# EAGLE design Tingle v3 (EAGLE 7.2.0)

## Sheet 1 of 3
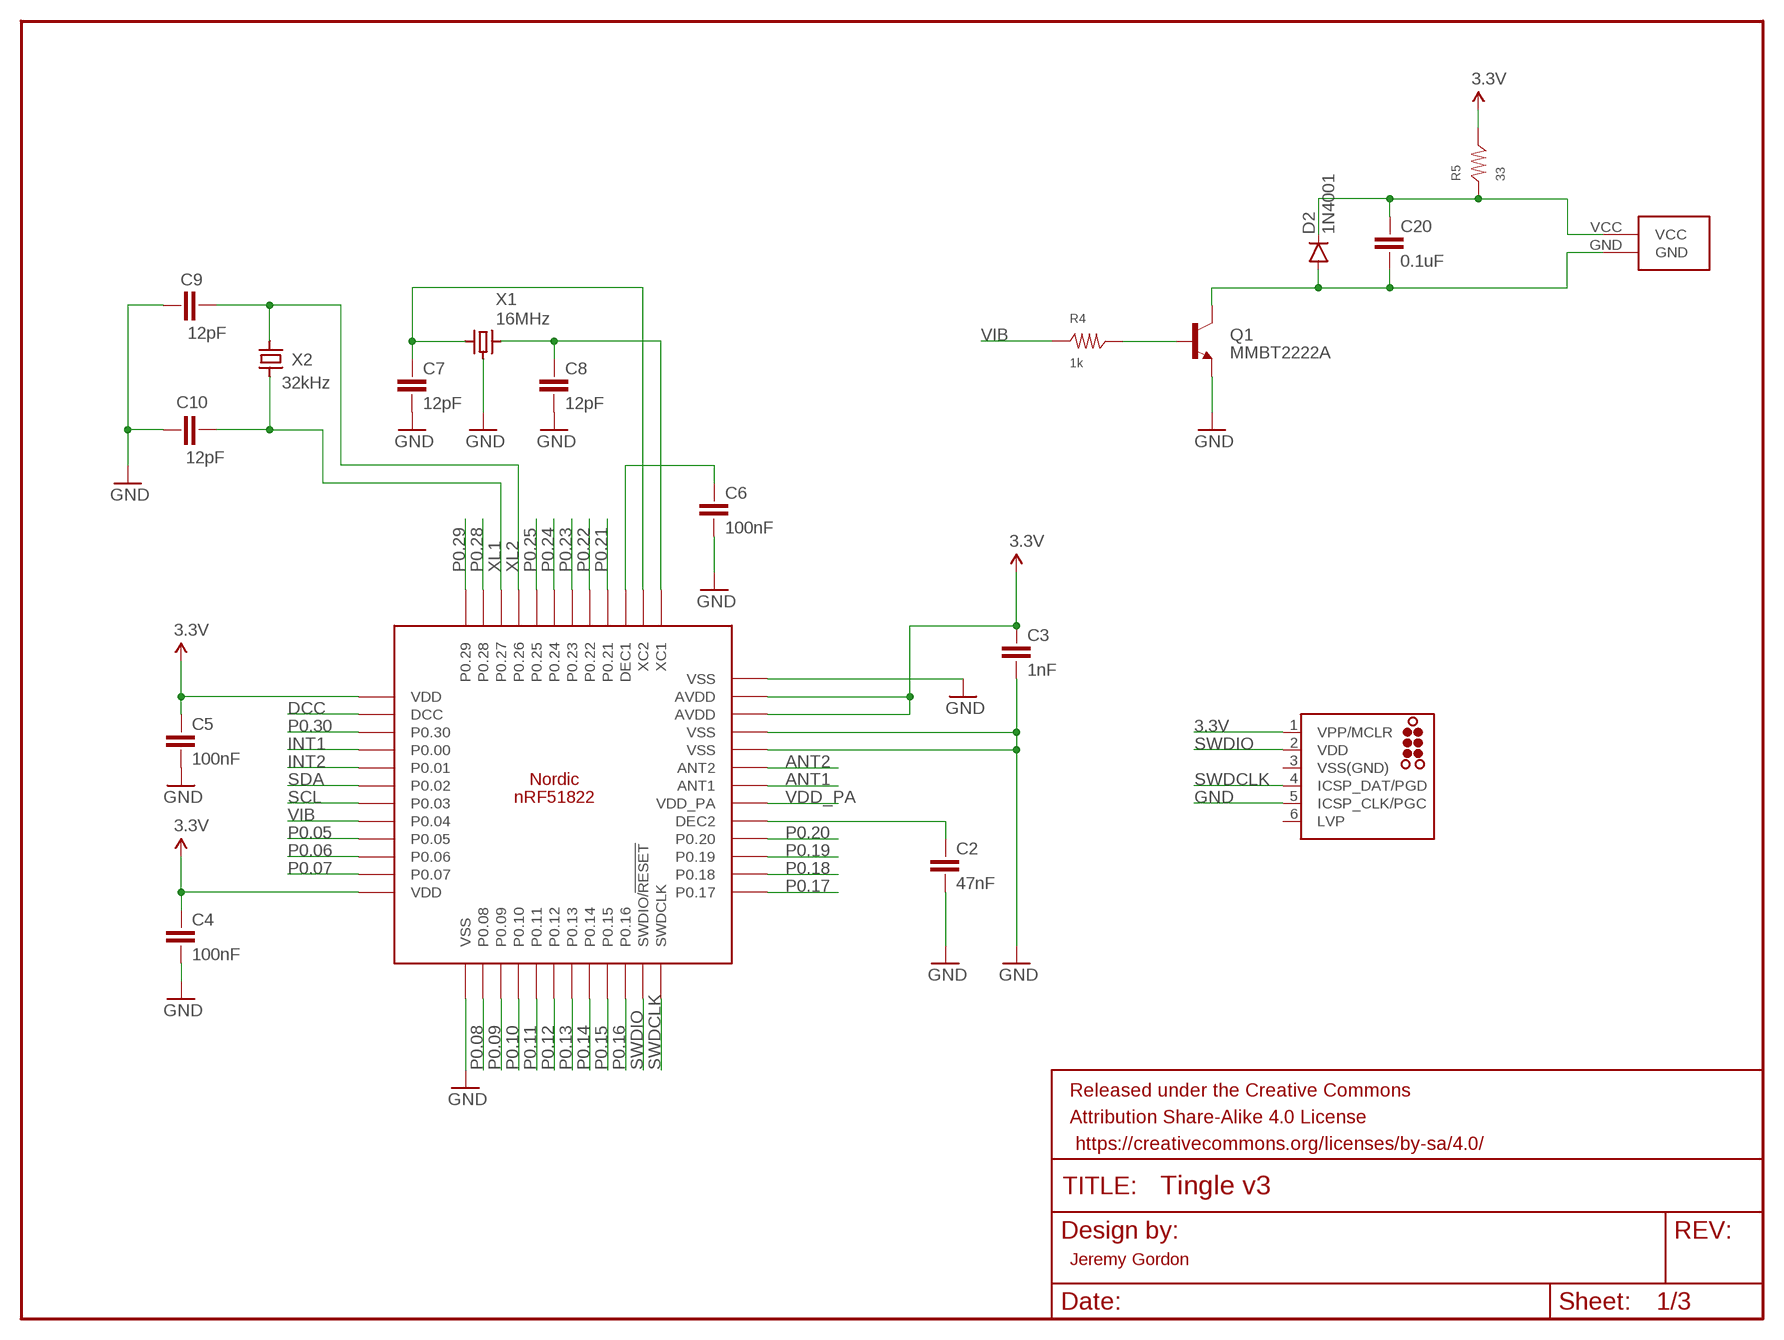
[diagram p0: schematic, sheet 1]

### Parts
C2  47nF  CAP-402  [CAP-402]
C3  1nF  CAP-402  [CAP-402]
C4  100nF  CAP-402  [CAP-402]
C5  100nF  CAP-402  [CAP-402]
C6  100nF  CAP-402  [CAP-402]
C7  12pF  CAP-402  [CAP-402]
C8  12pF  CAP-402  [CAP-402]
C9  12pF  CAP-402  [CAP-402]
C10  12pF  CAP-402  [CAP-402]
C20  0.1uF  CAP-402  [CAP-402]
D2  1N4001  DIODESOD  [SOD-323]
FRAME1  FRAME-LETTER  [CREATIVE_COMMONS]
J2  TC2030-MCP-NL  [TC2030-MCP-NL]
Q1  MMBT2222A  TRANSISTOR_NPNMMBT2222A  [SOT23-3]
R4  1k  RES-402  [RES-402]
R5  33  RES-402  [RES-402]
U1  NRF51822  [NRF51822]
U$1  CONN  [CONN]
X1  16MHz  CRYSTAL-GND2520  [CRYSTAL-2520]
X2  32kHz  CRYSTAL3215  [CRYSTAL-3215]

### Nets
3.3V: C3.2 C4.2 C5.2 J2.1(VPP/MCLR) R5.2 U1.AVDD@1(AVDD) U1.AVDD@2(AVDD) U1.VDD@1(VDD) U1.VDD@2(VDD) ; also sheet 3
ANT1: U1.ANT1 ; also sheet 2
ANT2: U1.ANT2 ; also sheet 2
DCC: U1.DCC
GND: C2.1 C3.1 C4.1 C5.1 C6.1 C7.1 C8.1 C9.2 C10.2 J2.5(ICSP_CLK/PGC) Q1.2(E) U1.VSS@1(VSS) U1.VSS@2(VSS) U1.VSS@3(VSS) U1.VSS@4(VSS) X1.GND@1(GND) X1.GND@2(GND) ; also sheet 2,3
INT1: U1.P0.00 ; also sheet 3
INT2: U1.P0.01 ; also sheet 3
N$1: C2.2 U1.DEC2
N$6: C6.2 U1.DEC1
N$7: C8.2 U1.XC1 X1.3
N$8: C7.2 U1.XC2 X1.1
N$13: Q1.1(B) R4.2
N$14: C20.2 D2.C R5.1 U$1.VCC
N$15: C20.1 D2.A Q1.3(C) U$1.GND
P0.05: U1.P0.05
P0.06: U1.P0.06
P0.07: U1.P0.07
P0.08: U1.P0.08
P0.09: U1.P0.09
P0.10: U1.P0.10
P0.11: U1.P0.11
P0.12: U1.P0.12
P0.13: U1.P0.13
P0.14: U1.P0.14
P0.15: U1.P0.15
P0.16: U1.P0.16
P0.17: U1.P0.17
P0.18: U1.P0.18
P0.19: U1.P0.19
P0.20: U1.P0.20
P0.21: U1.P0.21
P0.22: U1.P0.22
P0.23: U1.P0.23
P0.24: U1.P0.24
P0.25: U1.P0.25
P0.28: U1.P0.28
P0.29: U1.P0.29
P0.30: U1.P0.30
SCL: U1.P0.03 ; also sheet 3
SDA: U1.P0.02 ; also sheet 3
SWDCLK: J2.4(ICSP_DAT/PGD) U1.SWDCLK
SWDIO: J2.2(VDD) U1.SWDIO/!RESET
VDD_PA: U1.VDD_PA ; also sheet 2
VIB: R4.1 U1.P0.04
XL1: C10.1 U1.P0.27 X2.P$1
XL2: C9.1 U1.P0.26 X2.P$2
Unconnected: J2.6(LVP)

### Notes on the sheet
- Jeremy Gordon

## Sheet 2 of 3
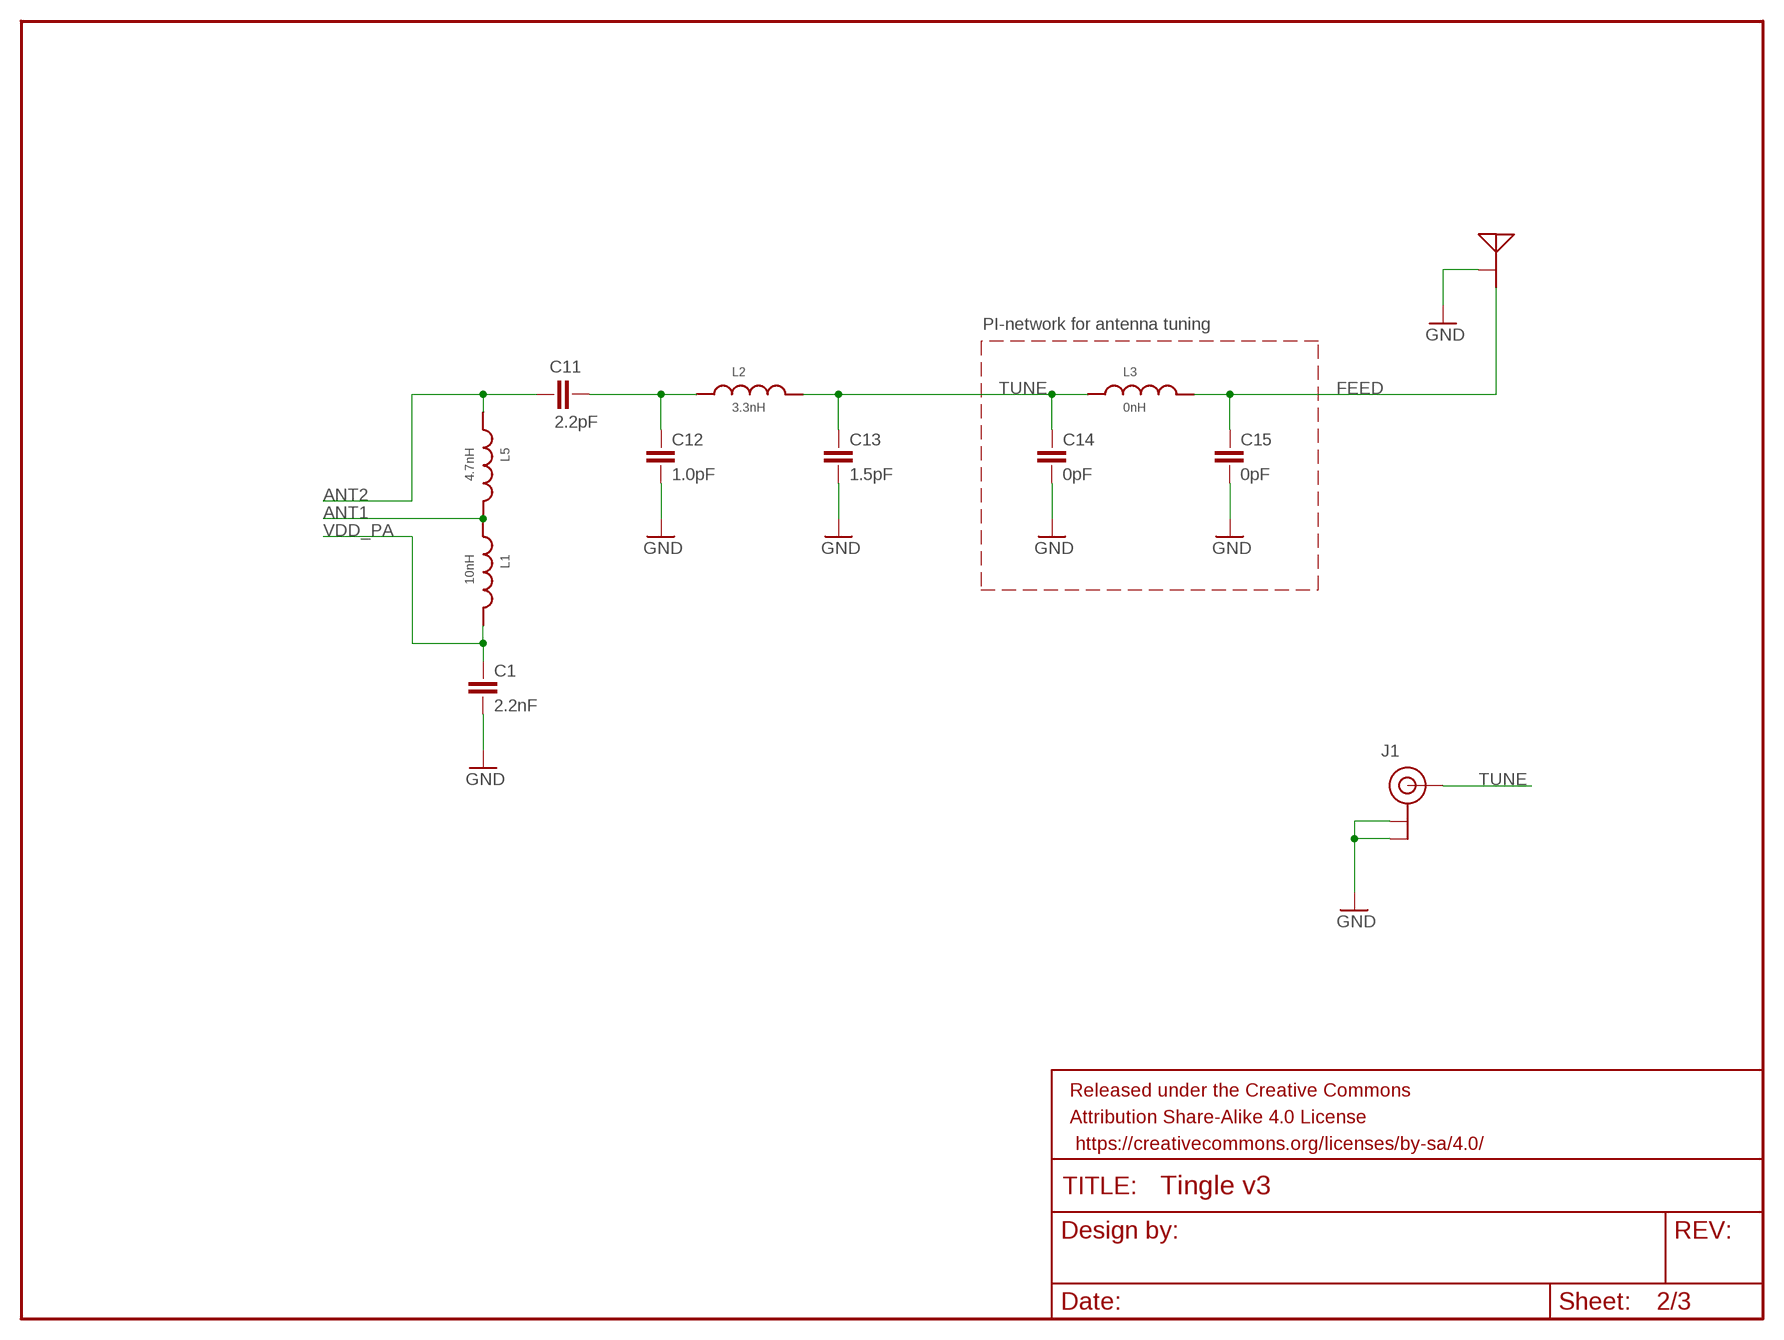
[diagram p1: schematic, sheet 2]

### Parts
C1  2.2nF  CAP-402  [CAP-402]
C11  2.2pF  CAP-402  [CAP-402]
C12  1.0pF  CAP-402  [CAP-402]
C13  1.5pF  CAP-402  [CAP-402]
C14  0pF  CAP-402  [CAP-402]
C15  0pF  CAP-402  [CAP-402]
FRAME3  FRAME-LETTER  [CREATIVE_COMMONS]
J1  U.FL  [U.FL]
L1  10nH  IND-402  [IND-402]
L2  3.3nH  IND-402  [IND-402]
L3  0nH  IND-402  [IND-402]
L5  4.7nH  IND-402  [IND-402]
U$2  MEANDER-ANT  [MEANDER-ANT]

### Nets
ANT1: L1.1 L5.2 ; also sheet 1
ANT2: C11.2 L5.1 ; also sheet 1
FEED: C15.2 L3.2 U$2.FEED
GND: C1.1 C12.1 C13.1 C14.1 C15.1 J1.P$1(GND) J1.P$2(GND) U$2.GND ; also sheet 1,3
N$5: C11.1 C12.2 L2.1
TUNE: C13.2 C14.2 J1.P$3(SIGNAL) L2.2 L3.1
VDD_PA: C1.2 L1.2 ; also sheet 1

### Notes on the sheet
- PI-network for antenna tuning

## Sheet 3 of 3
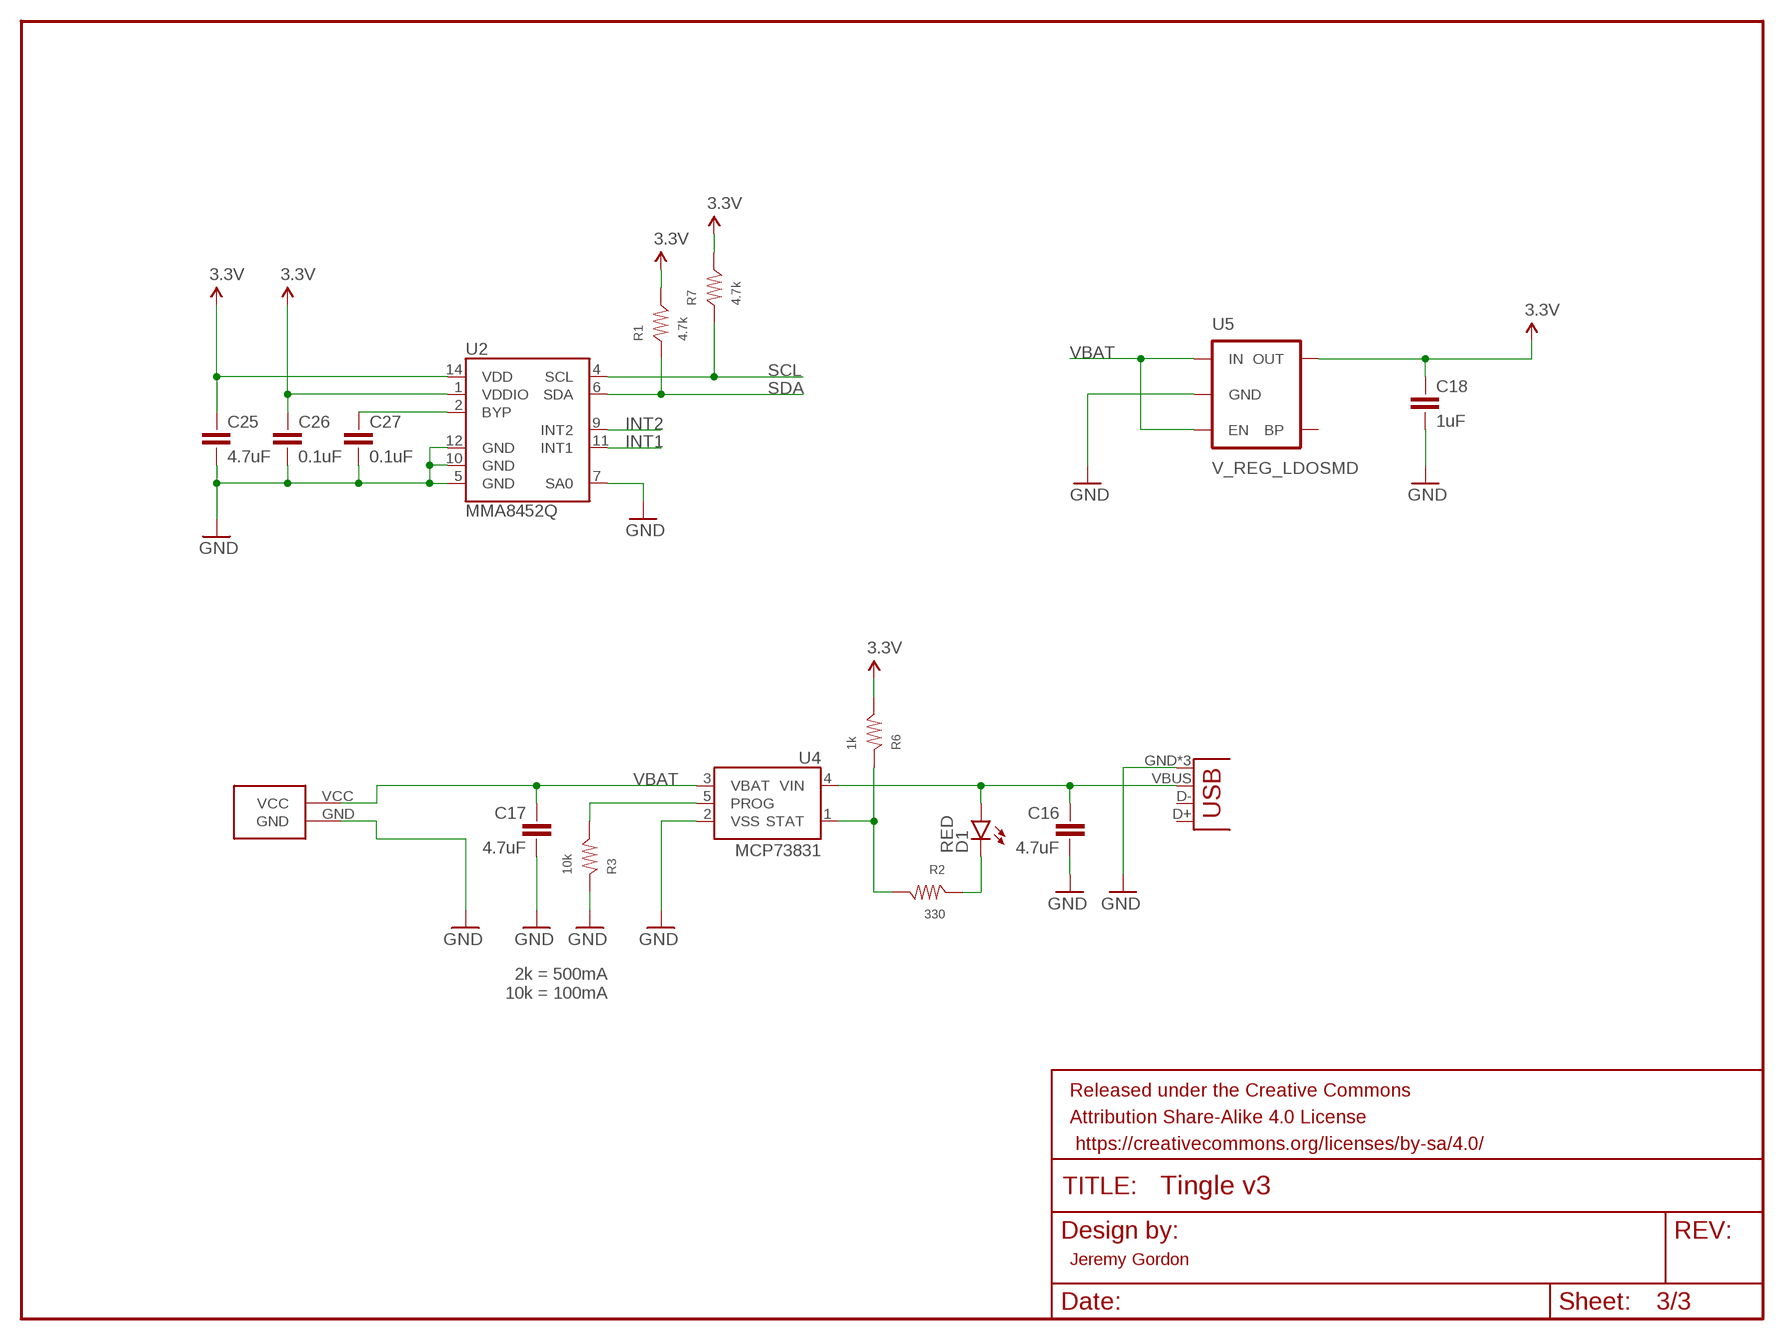
[diagram p2: schematic, sheet 3]

### Parts
C16  4.7uF  CAP-402  [CAP-402]
C17  4.7uF  CAP-402  [CAP-402]
C18  1uF  CAP-402  [CAP-402]
C25  4.7uF  CAP-402  [CAP-402]
C26  0.1uF  CAP-402  [CAP-402]
C27  0.1uF  CAP-402  [CAP-402]
D1  RED  LED-RED0603  [LED-0603]
FRAME2  FRAME-LETTER  [CREATIVE_COMMONS]
JP2  USB-MICROB  [USB-MICROB]
R1  4.7k  RES-402  [RES-402]
R2  330  RES-402  [RES-402]
R3  10k  RES-402  [RES-402]
R6  1k  RES-402  [RES-402]
R7  4.7k  RES-402  [RES-402]
U2  MMA8452Q  [QFN-16_0.5MM]
U4  MCP73831  [SOT23-5]
U5  V_REG_LDOSMD  [SOT23-5]
U$3  CONN  [CONN]

### Nets
3.3V: C18.2 C25.2 C26.2 R1.2 R6.2 R7.2 U2.1(VDDIO) U2.14(VDD) U5.5(OUT) ; also sheet 1
GND: C16.1 C17.1 C18.1 C25.1 C26.1 C27.1 JP2.GND JP2.MT1(GND) JP2.MT2(GND) R3.1 U2.5(GND) U2.7(SA0) U2.10(GND) U2.12(GND) U4.2(VSS) U5.2(GND) U$3.GND ; also sheet 1,2
INT1: U2.11(INT1) ; also sheet 1
INT2: U2.9(INT2) ; also sheet 1
N$3: C27.2 U2.2(BYP)
N$10: D1.C R2.1
PROG: R3.2 U4.5(PROG)
SCL: R7.1 U2.4(SCL) ; also sheet 1
SDA: R1.1 U2.6(SDA) ; also sheet 1
STAT: R2.2 R6.1 U4.1(STAT)
VBAT: C17.2 U4.3(VBAT) U5.1(IN) U5.3(EN) U$3.VCC
VBUS: C16.2 D1.A JP2.VBUS U4.4(VIN)
Unconnected: JP2.D+ JP2.D- U5.4(BP)

### Notes on the sheet
- 2k = 500mA
  10k = 100mA
- Jeremy Gordon

## Power pins joined to a net without a drawn wire
VSS(GND): J2.3(VSS(GND))

## Library data of the parts
C1-C18 C20 C25-C27 = Nordic:CAP-402
D1 = SparkFun-LED:LED-RED: Assorted Red LEDs LilyPad 1206- DIO-09912 1206- DIO-00809 0603- DIO-00819; PROD_ID: DIO-00819
D2 = SparkFun-DiscreteSemi:DIODE: Diode These are standard reverse protection diodes and small signal diodes. SMA package can handle up to about 1A. SOD-323 can handle about 200mA. What the SOD-323 package when ordering, there are some mfgs out there that are 5-pin packages.; PROD_ID: DIO-09646
FRAME1-FRAME3 = SparkFun-Aesthetics:FRAME-LETTER: Schematic Frame Standard 8.5x11 US Letter frame
J1 = SparkFun-Connectors:U.FL: SMD antenna connector- WRL-09144; PROD_ID: CONN-09193
J2 = tag-connect:TC2030: TAG-CONNECT ICSP Connector Manufacturer: Tag-Connect <http://www.tag-connect.com> Cable for easy In-Circuit Serial Programming. Designed for Microchip ICD2, suitable for many others. Two variants - one "with legs" (for hands-free fit on PCB) and another "without legs" for quick programming. PAD Description 1 MCLR/Vpp 2 Vdd 3 GND 4 PGD (ISPDAT) 5 PGC (ISPCLK) 6 nc (used for LVP) ©2009 ROFA.cz - modified and updated by Robert Darlington ‹rdarlington@gmail.com›
JP2 = SparkFun-Connectors:USB: USB Connectors USB-B-PTH is fully proven SKU : PRT-00139/CONN-08278 USB-miniB is fully proven SKU : PRT-00587 USB-A-PCB is untested. USB-A-H is throughly reviewed, but untested. Spark Fun Electronics SKU : PRT-00437 USB-B-SMT is throughly reviewed, but untested. Needs silkscreen touching up. USB-A-S has not been used/tested USB-MB-H has not been used/tested USB-MICROB has been used. CONN-09505; PROD_ID: CONN-09505
L1-L3 L5 = Nordic:IND-402
Q1 = SparkFun-DiscreteSemi:TRANSISTOR_NPN: Generic NPN BJT MMBT2222A - TRANS-08049 (SOT-23, 1A 40V) MPSA42 - TRANS-09116 (SOT-23, 500mA 300V) MMBT5088LT1G - TRANS-11160 (SOT-23, 50 mA 30V) BC547 - COM-08928 <http://www.sparkfun.com/products/8928> (TO-92 45V 100mA) (1.Collector 2.Base 3.Emitter) 2N3904 - COM-00521 <http://www.sparkfun.com/products/521> (TO-92 40V 200mA) (1.Emitter 2.Base 3.Collector) P2N2222A - COM-12852 <http://www.sparkfun.com/products/12852> (TO-92 40V 600mA) (1.Collector 2.Base 3.Emitter); PROD_ID: TRANS-08049
R1-R7 = Nordic:RES-402
U1 = Nordic:NRF51822
U2 = SparkFun-Sensors:MMA8452Q: MMA8452Q 3-Axis, 12/8-bit Digital Accelerometer Supply Voltage: 1.6-3.6V Range: +/- 2g, 4g, 8g Interface: I2C, 12-bit and 8-bit ODR: 1.56 Hz - 800 Hz Package: QFN-16 http://cache.freescale.com/files/sensors/doc/data_sheet/MMA8452Q.pdf; PROD_ID: IC-10769
U4 = SparkFun-PowerIC:MCP73831: Miniature single cell, fully integrated Li-Ion, Li-polymer charge management controller http://ww1.microchip.com/downloads/en/DeviceDoc/21984a.pdf IC-09995; PROD_ID: IC-09995
U5 = SparkFun-PowerIC:V_REG_LDO: Voltage Regulator LDO Standard 150mA LDO voltage regulator in SOT-23 layout. Micrel part MIC5205. BP (by-pass) pin is used to lower output noise with 470pF cap.
U$1 U$3 = MDBT40:CONN
U$2 = Nordic:MEANDER-ANT
X1 = Nordic:CRYSTAL-GND
X2 = Nordic:CRYSTAL

## Board
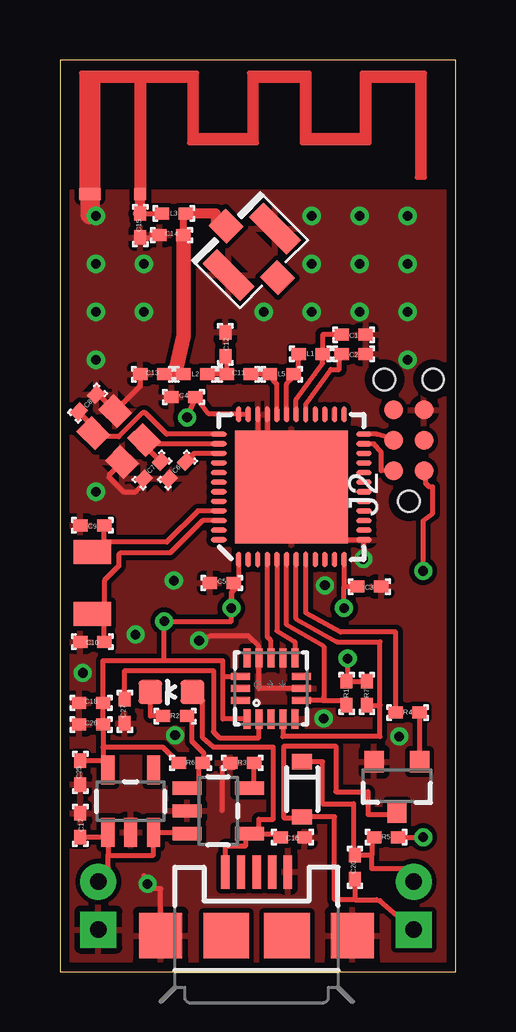
[diagram p3: board, top side]
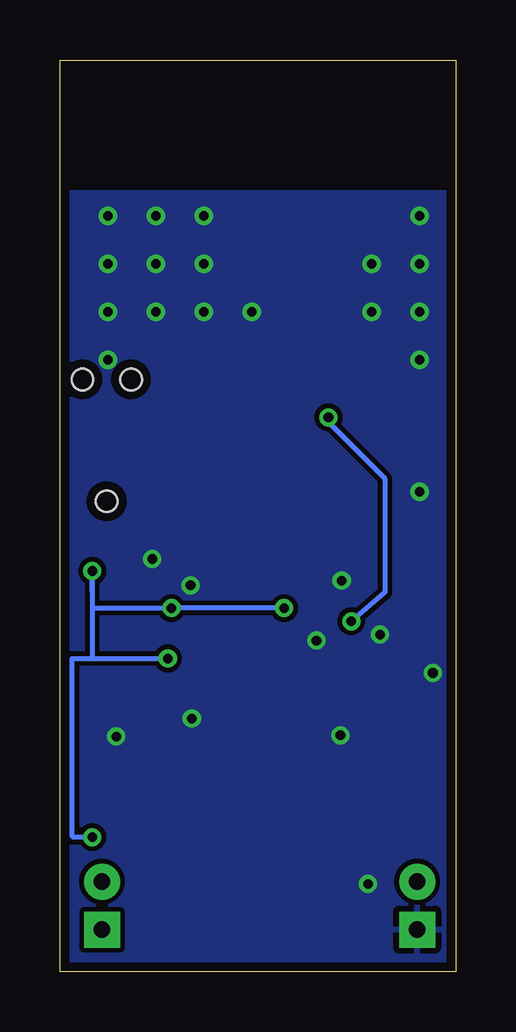
[diagram p4: board, bottom side, seen from below]

Size 16.5 x 38 mm. Coordinates in mm from the lower left corner, seen from the top.
Outline: 0,0 16.5,0 16.5,38 0,38 0,0
Copper layers (1*16): Top 0.0356mm / dielectric 1.5011mm / Bottom 0.0356mm
Design rules "LaenPCBOrder *": minimum track width 6mil, minimum drill 13mil, track to track 0.2mm, track to pad 0.2mm, pad to pad 0.2mm, via to via 0.2mm, smd to smd 0.2mm, copper to edge 15mil, drill to drill 6mil, minimum pad ring 7mil, minimum via ring 7mil, stop-mask expansion 3mil, vias tented up to drill 0mil, thermal gap 10mil
tRestrict: area 7,17.9 to 7.3,22.6; area 12,18.2 to 12.4,22.6

### Footprints (pad centres in the part's own frame; a part is rotated, then mirrored left to right if it is on the bottom)
CAP-402 = smd 0.6 x 0.5: 1 -0.5,0; 2 0.5,0
LED-0603 = smd 1 x 1: A 0,-0.877; C 0,0.877
SOD-323 = smd 0.63 x 0.83: A 1.15,0; C -1.15,0
U.FL = smd 2.2 x 0.85: P$1 0,1.375; P$2 0,-1.375 | smd 1.05 x 1: P$3 1.525,0; P$4 -1.525,0
TC2030-MCP-NL = smd 0.787 x 0.787: 1 1.27,-0.635; 2 1.27,0.635; 3 2.54,-0.635; 4 2.54,0.635; 5 3.81,-0.635; 6 3.81,0.635 | hole 0.889: 0,0; 5.08,-1.016; 5.08,1.016
USB-MICROB = smd 0.35 x 1.4: D+ 0,2.65; D- -0.65,2.65; GND 1.3,2.65; ID 0.65,2.65; VBUS -1.3,2.65 | smd 1.8 x 1.9: MT1 -4,0; MT2 4,0 | smd 1.9 x 1.9: P$1 -1.27,0; P$2 1.27,0
IND-402 = smd 0.6 x 0.5: 1 -0.5,0; 2 0.5,0
SOT23-3 = smd 0.8 x 0.9: 1 -0.95,-1; 2 0.95,-1; 3 0,1.1
RES-402 = smd 0.6 x 0.5: 1 -0.5,0; 2 0.5,0
NRF51822 = smd 0.65 x 0.2: ANT1 3.025,0.2; ANT2 3.025,0.6; AVDD@1 3.025,1.8; AVDD@2 3.025,2.2; DCC -3.025,1.8; DEC2 3.025,-0.6; P0.00 -3.025,1; P0.01 -3.025,0.6; P0.02 -3.025,0.2; P0.03 -3.025,-0.2; P0.04 -3.025,-0.6; P0.05 -3.025,-1; P0.06 -3.025,-1.4; P0.07 -3.025,-1.8; P0.17 3.025,-2.2; P0.18 3.025,-1.8; P0.19 3.025,-1.4; P0.20 3.025,-1; P0.30 -3.025,1.4; VDD@1 -3.025,2.2; VDD@2 -3.025,-2.2; VDD_PA 3.025,-0.2; VSS@2 3.025,1; VSS@3 3.025,1.4 | smd 0.2 x 0.65: DEC1 1.4,3.025; P0.08 -1.8,-3.025; P0.09 -1.4,-3.025; P0.10 -1,-3.025; P0.11 -0.6,-3.025; P0.12 -0.2,-3.025; P0.13 0.2,-3.025; P0.14 0.6,-3.025; P0.15 1,-3.025; P0.16 1.4,-3.025; P0.21 1,3.025; P0.22 0.6,3.025; P0.23 0.2,3.025; P0.24 -0.2,3.025; P0.25 -0.6,3.025; P0.26 -1,3.025; P0.27 -1.4,3.025; P0.28 -1.8,3.025; P0.29 -2.2,3.025; SWDCLK 2.2,-3.025; SWDIO/!RESET 1.8,-3.025; VSS@1 -2.2,-3.025; XC1 2.2,3.025; XC2 1.8,3.025 | smd 4.7 x 4.7: VSS@4 0,0
QFN-16_0.5MM = smd 0.8 x 0.3: 1 -1.275,1; 2 -1.275,0.5; 3 -1.275,0; 4 -1.275,-0.5; 5 -1.275,-1; 9 1.275,-1; 10 1.275,-0.5; 11 1.275,0; 12 1.275,0.5; 13 1.275,1 | smd 0.3 x 0.8: 6 -0.5,-1.275; 7 0,-1.275; 8 0.5,-1.275; 14 0.5,1.275; 15 0,1.275; 16 -0.5,1.275
SOT23-5 = smd 0.55 x 1.2: 1 -0.95,-1.3; 2 0,-1.3; 3 0.95,-1.3; 4 0.95,1.3; 5 -0.95,1.3
CONN = drill 0.7 pad 1.5 square: GND 0,1 | drill 0.7 pad 1.5: VCC 0,-1
MEANDER-ANT = smd 0.5 x 0.5: FEED 2.55,-0.25 | smd 0.9 x 0.5: GND 0.45,-0.25
CRYSTAL-2520 = smd 1.1 x 0.9: 1 -0.85,-0.65; 3 0.85,0.65; GND@1 -0.85,0.65; GND@2 0.85,-0.65
CRYSTAL-3215 = smd 1 x 1.55: P$1 -1.3,0; P$2 1.3,0

### Placement (x,y rotation side)
C1  12.25,26.55 180 top
C2  12.25,25.75 180 top
C3  12.9,16.05 180 top
C4  5.15,23.95 0 top
C5  6.75,16.2 0 top
C6  4.9,20.9 45 top
C7  3.85,20.9 45 top
C8  1.15,23.7 225 top
C9  1.35,18.6 180 top
C10  1.35,13.75 180 top
C11  7.45,24.9 0 top
C12  6.9,26.15 270 top
C13  3.85,24.9 0 top
C14  4.65,30.7 0 top
C15  3.35,31.1 90 top
C16  9.7,5.6 180 top
C17  0.85,6.1 270 top
C18  1.3,11.2 0 top
C20  12.3,4.35 90 top
C25  0.85,8.3 90 top
C26  1.3,10.3 0 top
C27  2.7,10.85 90 top
D1  4.65,11.65 90 top
D2  10.1,7.6 270 top
FRAME1  -16.9,-15.6 0 top  (outside the outline)
FRAME2  -16.9,-15.6 0 top  (outside the outline)
FRAME3  -16.9,-15.6 0 top  (outside the outline)
J1  8,30 135 top
J2  14.55,19.6 90 top
JP2  8.2,1.5 0 top
L1  10.45,25.75 0 top
L2  5.65,24.9 180 top
L3  4.75,31.6 180 top
L5  9.25,24.9 0 top
Q1  14.05,7.75 180 top
R1  11.95,11.6 90 top
R2  4.8,10.65 0 top
R3  7.6,8.7 0 top
R4  14.5,10.8 0 top
R5  13.6,5.6 0 top
R6  5.45,8.7 180 top
R7  12.8,11.6 90 top
U1  9.65,20.2 90 top
U2  8.8,11.8 90 top
U4  6.6,6.7 270 top
U5  2.95,7.1 0 top
U$1  14.75,2.75 180 top
U$2  0.8,32.65 0 top
U$3  1.6,2.75 180 top
X1  2.45,22.3 135 top
X2  1.35,16.2 90 top

### Tracks (layer width: path | path; a pad name or v marks a point on that pad's centre or on a via)
3.3V  (via drill 0.4)
  Top 0.2: U1.VDD@2 11.85,16.05 | U1.AVDD@1 U1.AVDD@2 7.42,23.25 6.2,23.25 C4.2 5.35,23.25 v5.3,23.1 | v7.15,15.15 7.15,14.6 v4.35,14.6 4.35,12.95 | v7.15,15.15 7.15,15.7 C5.2 7.45,16 U1.VDD@1 7.45,16.1 7.15,15.8 v7.15,15.15 | v11.85,15.15 11.85,16.05 | 11.85,16.05 C3.2 | U5.5 1.85,8.7 1.85,8.8 1.8,8.8 | C25.2 1.8,8.8 | 4.35,12.95 1.8,12.95 C18.2 C26.2 1.8,9.35 | 1.8,9.35 1.8,8.8 | R5.2 v15.15,5.6 | 12,12.1 R7.2 | 6.8,12.3 6.8,10.53 U2.1 | 6.8,12.3 U2.14 | R1.2 12,12.1 | 12,12.1 v12,13.05 | 6.8,12.3 6.8,12.95 4.35,12.95 | v15.15,16.7 15.15,18.8 15.55,19.1 15.55,20.2 15.4,20.2 15.25,20.35 15.25,20.8 J2.1 | R6.2 4.3,9.35 1.8,9.35
  Bottom 0.2: v5.3,23.1 5.35,22.95 2.95,20.55 2.95,15.8 v4.35,14.6 | v7.15,15.15 v11.85,15.15 15.1,15.15 15.15,15.2 | 15.15,15.85 v15.15,16.7 15.15,15.2 | v15.15,5.6 15.95,5.6 16,5.65 16,13.05 15.15,13.05 | 15.15,15.2 15.15,13.05 | 15.15,13.05 v12,13.05
ANT1
  Top 0.2: U1.ANT1 9.45,24.5 9.6,24.65 | 9.6,24.65 9.75,24.8 | 9.6,24.65 9.6,24.75 L5.2 9.95,25.1 L1.1
ANT2
  Top 0.2: U1.ANT2 9.05,24.5 8.75,24.8 L5.1 C11.2
FEED
  Top 0.2: C15.2 L3.2
  Top 0.406: C15.2 U$2.FEED
  Top 0.45: C15.2 3.28,31.6
GND  (via drill 0.4)
  Top 0.2: 11.55,18 U1.VSS@1 12.65,17.98 v12.65,17.2 | U1.VSS@2 8.65,20.2 8.25,20.2 U1.VSS@3 | C7.1 3.6,20.45 3.15,20 2.65,20 2.05,20.6 2.05,20.7 X1.GND@1 | C8.1 1.62,24.05 X1.GND@2 3.35,24.4 C13.1 | C15.1 3.85,30.6 3.85,30.85 C14.1 | v1.5,31.5 1.25,31.55 | JP2.MT1 4.2,3.45 3.5,3.45 3.5,4 | R3.1 7.25,8.5 6.75,8.5 6.75,6.7 | U2.7 8.3,11.8 8.3,13.55 7.85,14 6.3,14 v5.8,13.8
  Top 0.254: 11.55,18 11.55,20.2
  Top 0.813: 1.25,31.55 U$2.GND
  other vias: 1.5,29.5 3.5,29.5 8.5,27.5 14.5,31.5 10.5,29.5 1.5,27.5 3.5,27.5 14.5,27.5 10.5,27.5 10.5,31.5 12.5,31.5 12.5,29.5 12.5,27.5 14.5,29.5 3.65,3.65 4.75,16.3 11,10.55 3.15,14.05 14.15,9.8 1.5,20 1.5,25.5 14.5,25.5 11.05,16.1 4.8,9.85 0.95,12.45
  pour Top (isolate 0.2, rank 2): 0,32.5 0,0 16.5,0 16.5,32.5
  pour Bottom (isolate 0.2): 0,32.5 0,0 16.5,0 16.5,32.5
INT1
  Top 0.2: U1.P0.00 8.65,13.95 8.8,13.8 U2.11
INT2
  Top 0.2: U1.P0.01 9.05,14.2 9.8,13.75 U2.9
N$1
  Top 0.2: U1.DEC2 10.25,23.65 11.3,25.1 11.65,25.1 11.65,25.25 11.65,25.75 C2.2
N$3
  Top 0.2: C27.2 2.7,12.55 6.4,12.55 6.4,10 6.65,9.75 8.3,9.75 U2.2
N$5
  Top 0.2: C12.2 6.95,25.6 C11.1 L2.1
N$6
  Top 0.2: U1.DEC1 5.6,21.6 C6.2
N$7
  Top 0.18: 3.45,23.3 2.45,22.3
  Top 0.2: U1.XC1 4.45,22.4 3.55,23.3 3.45,23.3 | 2.45,22.3 1.53,22.3 X1.3 1.15,22.68 1.15,22.95 0.8,23.3 C8.2
N$8
  Top 0.2: U1.XC2 3.67,22 X1.1 3.75,21.92 3.75,21.7 C7.2
N$10
  Top 0.2: R2.1 3.77,10.65 D1.C
N$13
  Top 0.2: Q1.1 R4.2
N$14
  Top 0.2: D2.C 10.95,8.75 10.95,7 12.25,7 12.25,4.85 C20.2 13,4.85 | 13,4.85 13,4.3 14.75,4.3 U$1.VCC | R5.1 13,5.6 13,4.85
N$15
  Top 0.2: Q1.3 14.05,6.55 12.85,6.55 12.85,7.5 11.5,7.5 11.5,9.4 9.35,9.4 9.35,6.4 10.05,6.4 D2.A 11.45,6.45 11.45,3 12.3,3 | C20.1 12.3,3 | 12.3,3 13.2,3 13.35,2.95 U$1.GND
PROG
  Top 0.2: U4.5 8.1,7.7 R3.2
SCL
  Top 0.2: U2.4 9.3,9.8 13.35,9.8 13.35,11.1 | U1.P0.03 9.85,14.7 11.55,13.75 13.35,13.75 13.35,11.1 | R7.1 13.35,11.1
SDA
  Top 0.2: 10.97,11.3 11,11.45 11,13.55 9.45,14.45 U1.P0.02 | 10.97,11.3 U2.6 | 10.97,11.3 11.95,11.3 R1.1
STAT
  Top 0.2: 4.95,7.65 U4.1 5.8,7.65 5.8,8.7 R6.1 6,8.7 6,9.1 5.5,9.6 5.5,10.65 R2.2
SWDCLK
  Top 0.2: 12.9,22.4 U1.SWDCLK 13.2,22.4 13.9,22.2 J2.4
SWDIO
  Top 0.2: J2.2 13.4,20.89 13.4,21.65 13.1,22 U1.SWDIO/!RESET
TUNE
  Top 0.2: C13.2 4.8,24.95 L2.2 | 5.15,31.6 L3.1
  Top 0.3: C14.2 5.15,31.6
  Top 0.406: J1.P$3 6.5,31.08 6.5,31.6 L3.1
  Top 0.6: C14.2 5.15,26.5 4.8,24.95
VBAT
  Top 0.2: 2,4.85 2,4.35 2,4 U$3.VCC | 2,5.6 C17.2 | U5.1 2,5.6 | 2,5.6 2,4.85 | 2,4.85 3.9,4.85 U5.3 5.2,5.8 U4.3
VBUS
  Top 0.2: JP2.VBUS 6.9,5.25 7.75,5.25 7.75,5.5 U4.4 8.3,5.75 | 8.3,5.75 8.3,6.35 8.9,6.35 8.9,9.35 6.4,9.35 5.95,9.75 5.95,11.3 D1.A | 8.3,5.75 8.95,5.75 C16.2
VDD_PA
  Top 0.2: U1.VDD_PA 9.85,23.85 10.95,25.35 L1.2 10.95,26.55 C1.2
VIB
  Top 0.2: R4.1 14,14.15 11.7,14.15 10.25,14.95 U1.P0.04
XL1
  Top 0.2: U1.P0.27 5.95,18.8 4.6,17.45 2.55,17.45 2.45,17.4 2.45,16.9 1.85,16.3 1.85,15.4 1.7,15.25 | 1.7,15.25 X2.P$1 | C10.1 1.85,15.1 1.7,15.25
XL2
  Top 0.2: U1.P0.26 5.75,19.2 4.45,17.9 1.85,17.9 | X2.P$2 1.75,17.9 1.85,17.9 | 1.85,17.9 C9.1